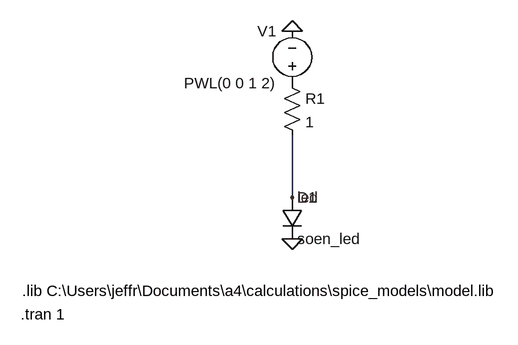
[diagram p0: schematic led.asc]
led.asc, the LTspice schematic file:
Version 4
SHEET 1 880 680
WIRE 256 192 256 96
FLAG 256 256 0
FLAG 256 -64 0
FLAG 256 192 led
SYMBOL diode 240 192 R0
SYMATTR InstName D1
SYMATTR Value soen_led
SYMBOL voltage 256 32 R180
WINDOW 0 24 96 Left 2
WINDOW 3 24 16 Left 2
WINDOW 123 0 0 Left 0
WINDOW 39 0 0 Left 0
SYMATTR InstName V1
SYMATTR Value PWL(0 0 1 2)
SYMBOL res 240 0 R0
SYMATTR InstName R1
SYMATTR Value 1
TEXT -160 336 Left 2 !.lib C:\\Users\\jeffr\\Documents\\a4\\calculations\\spice_models\\model.lib
TEXT -162 372 Left 2 !.tran 1

The netlist it stands for:
* led.asc
D1 led 0 soen_led
V1 P001 0 PWL(0 0 1 2)
R1 P001 led 1
.model D D
.lib standard.dio
.lib C:\Users\jeffr\Documents\a4\calculations\spice_models\model.lib
.tran 1
.backanno
.end